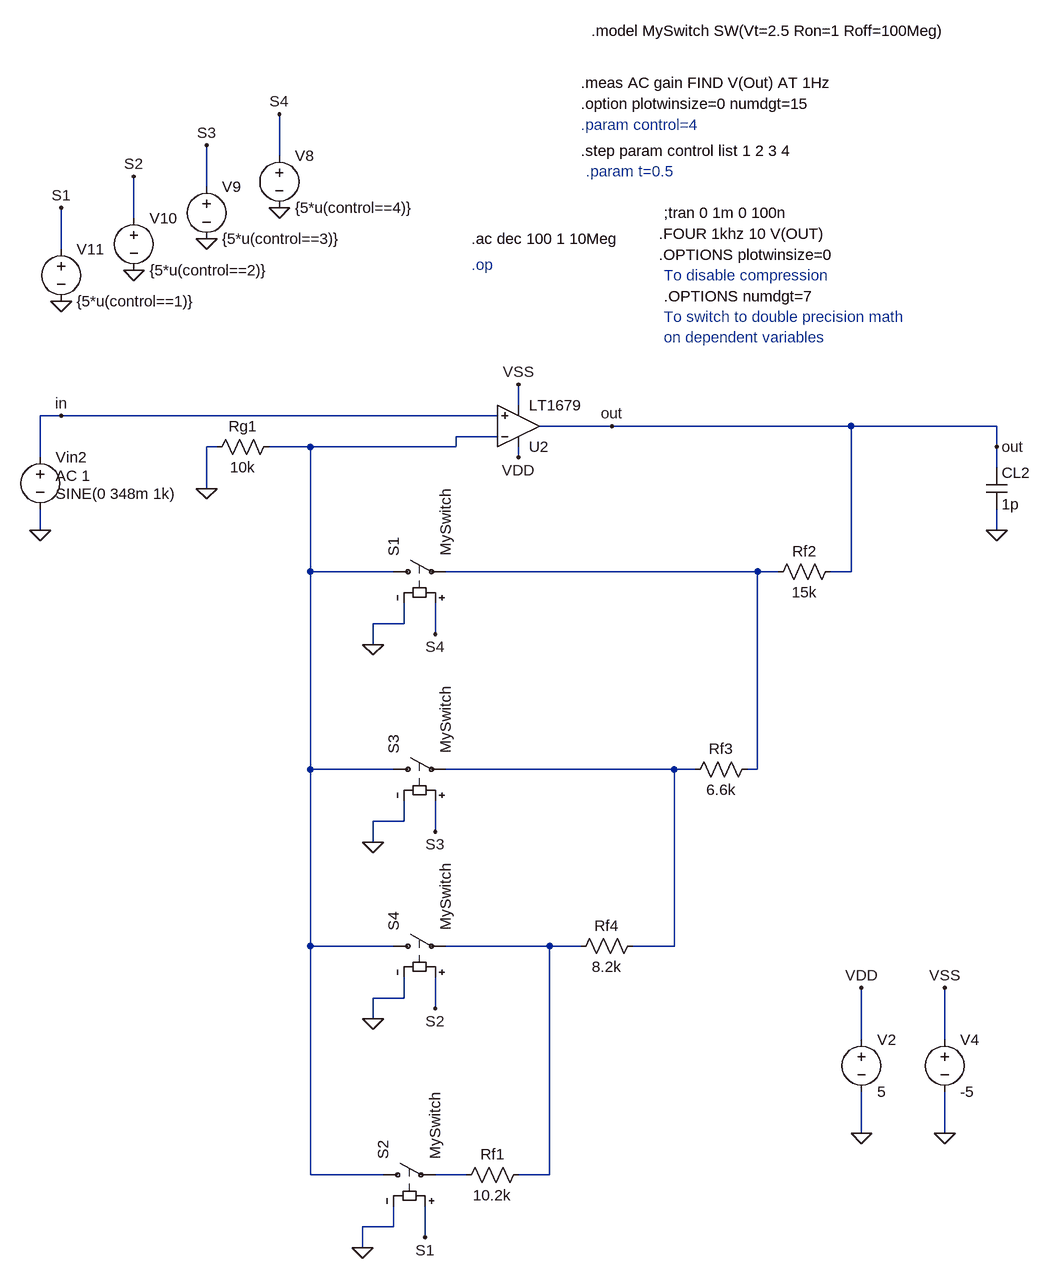
[diagram p0: schematic Etaj_3_PGA_ac.asc]
Etaj_3_PGA_ac.asc, the LTspice schematic file:
Version 4.1
SHEET 1 2136 1308
WIRE -880 -480 -880 -544
WIRE -992 -432 -992 -496
WIRE -1104 -384 -1104 -448
WIRE -1216 -336 -1216 -400
WIRE -512 -96 -512 -128
WIRE -1216 -80 -1248 -80
WIRE -544 -80 -1216 -80
WIRE -368 -64 -480 -64
WIRE 0 -64 -368 -64
WIRE 224 -64 0 -64
WIRE -544 -48 -608 -48
WIRE -976 -32 -992 -32
WIRE -832 -32 -896 -32
WIRE -608 -32 -608 -48
WIRE -608 -32 -832 -32
WIRE 224 -32 224 -64
WIRE -1248 -16 -1248 -80
WIRE -512 -16 -512 -32
WIRE 224 0 224 -32
WIRE -992 32 -992 -32
WIRE -1248 96 -1248 64
WIRE 224 96 224 64
WIRE -832 160 -832 -32
WIRE -704 160 -832 160
WIRE -144 160 -624 160
WIRE -112 160 -144 160
WIRE 0 160 0 -64
WIRE 0 160 -32 160
WIRE -688 240 -688 208
WIRE -688 240 -736 240
WIRE -640 256 -640 208
WIRE -736 272 -736 240
WIRE -832 464 -832 160
WIRE -704 464 -832 464
WIRE -272 464 -624 464
WIRE -240 464 -272 464
WIRE -144 464 -144 160
WIRE -144 464 -160 464
WIRE -688 544 -688 512
WIRE -688 544 -736 544
WIRE -640 560 -640 512
WIRE -736 576 -736 544
WIRE -832 736 -832 464
WIRE -704 736 -832 736
WIRE -464 736 -624 736
WIRE -416 736 -464 736
WIRE -272 736 -272 464
WIRE -272 736 -336 736
WIRE -688 816 -688 784
WIRE -688 816 -736 816
WIRE -640 832 -640 784
WIRE -736 848 -736 816
WIRE 16 880 16 800
WIRE 144 880 144 800
WIRE 16 1024 16 960
WIRE 144 1024 144 960
WIRE -832 1088 -832 736
WIRE -720 1088 -832 1088
WIRE -592 1088 -640 1088
WIRE -464 1088 -464 736
WIRE -464 1088 -512 1088
WIRE -704 1168 -704 1136
WIRE -704 1168 -752 1168
WIRE -656 1184 -656 1136
WIRE -752 1200 -752 1168
FLAG -1216 -256 0
FLAG -1104 -304 0
FLAG -992 -352 0
FLAG -880 -400 0
FLAG -1216 -400 S1
FLAG -1104 -448 S2
FLAG -992 -496 S3
FLAG -880 -544 S4
FLAG 16 1024 0
FLAG 16 800 VDD
FLAG -1248 96 0
FLAG -992 32 0
FLAG -368 -64 out
FLAG -512 -16 VDD
FLAG -512 -128 VSS
FLAG 224 96 0
FLAG -1216 -80 in
FLAG 144 1024 0
FLAG 144 800 VSS
FLAG -656 1184 S1
FLAG -736 272 0
FLAG -640 832 S2
FLAG -736 576 0
FLAG -640 560 S3
FLAG -736 848 0
FLAG -640 256 S4
FLAG -752 1200 0
FLAG 224 -32 out
DATAFLAG -1216 -368 ""
DATAFLAG -1104 -416 ""
DATAFLAG -992 -464 ""
DATAFLAG -880 -512 ""
DATAFLAG -720 -32 ""
DATAFLAG -112 -64 ""
DATAFLAG 112 -64 ""
SYMBOL voltage -880 -496 R0
WINDOW 123 0 0 Left 0
WINDOW 39 0 0 Left 0
SYMATTR InstName V8
SYMATTR Value {5*u(control==4)}
SYMBOL voltage -992 -448 R0
WINDOW 123 0 0 Left 0
WINDOW 39 0 0 Left 0
SYMATTR InstName V9
SYMATTR Value {5*u(control==3)}
SYMBOL voltage -1104 -400 R0
WINDOW 123 0 0 Left 0
WINDOW 39 0 0 Left 0
SYMATTR InstName V10
SYMATTR Value {5*u(control==2)}
SYMBOL voltage -1216 -352 R0
WINDOW 123 0 0 Left 0
WINDOW 39 0 0 Left 0
SYMATTR InstName V11
SYMATTR Value {5*u(control==1)}
SYMBOL voltage 16 864 R0
WINDOW 123 0 0 Left 2
WINDOW 39 0 0 Left 2
SYMATTR InstName V2
SYMATTR Value 5
SYMBOL res -880 -48 R90
WINDOW 0 0 56 VBottom 2
WINDOW 3 32 56 VTop 2
SYMATTR InstName Rg1
SYMATTR Value 10k
SYMBOL res -496 1072 R90
WINDOW 0 0 56 VBottom 2
WINDOW 3 32 56 VTop 2
SYMATTR InstName Rf1
SYMATTR Value 10.2k
SYMBOL voltage -1248 -32 R0
WINDOW 123 24 44 Left 2
WINDOW 39 0 0 Left 2
WINDOW 3 24 72 Left 2
SYMATTR Value2 AC 1
SYMATTR Value SINE(0 348m 1k)
SYMATTR InstName Vin2
SYMBOL res -16 144 R90
WINDOW 0 0 56 VBottom 2
WINDOW 3 32 56 VTop 2
SYMATTR InstName Rf2
SYMATTR Value 15k
SYMBOL res -144 448 R90
WINDOW 0 0 56 VBottom 2
WINDOW 3 32 56 VTop 2
SYMATTR InstName Rf3
SYMATTR Value 6.6k
SYMBOL res -320 720 R90
WINDOW 0 0 56 VBottom 2
WINDOW 3 32 56 VTop 2
SYMATTR InstName Rf4
SYMATTR Value 8.2k
SYMBOL cap 208 0 R0
SYMATTR InstName CL2
SYMATTR Value 1p
SYMBOL OpAmps\\LT1679 -512 -64 M180
SYMATTR InstName U2
SYMBOL voltage 144 864 R0
WINDOW 123 0 0 Left 2
WINDOW 39 0 0 Left 2
SYMATTR InstName V4
SYMATTR Value -5
SYMBOL sw -720 160 R270
SYMATTR InstName S1
SYMATTR Value MySwitch
SYMBOL sw -736 1088 R270
SYMATTR InstName S2
SYMATTR Value MySwitch
SYMBOL sw -720 464 R270
SYMATTR InstName S3
SYMATTR Value MySwitch
SYMBOL sw -720 736 R270
SYMATTR InstName S4
SYMATTR Value MySwitch
TEXT -584 -352 Left 2 !.ac dec 100 1 10Meg
TEXT -584 -312 Left 2 ;.op
TEXT -288 -392 Left 2 !;tran 0 1m 0 100n
TEXT -296 -360 Left 2 !.FOUR 1khz 10 V(OUT)
TEXT -296 -328 Left 2 !.OPTIONS plotwinsize=0
TEXT -288 -296 Left 2 ;To disable compression
TEXT -288 -264 Left 2 !.OPTIONS numdgt=7
TEXT -288 -232 Left 2 ;To switch to double precision math\non dependent variables
TEXT -416 -528 Left 2 ;.param control=4
TEXT -416 -488 Left 2 !.step param control list 1 2 3 4
TEXT -416 -592 Left 2 !.meas AC gain FIND V(Out) AT 1Hz
TEXT -416 -560 Left 2 !.option plotwinsize=0 numdgt=15
TEXT -408 -456 Left 2 ;.param t=0.5
TEXT -400 -672 Left 2 !.model MySwitch SW(Vt=2.5 Ron=1 Roff=100Meg)

The netlist it stands for:
* Etaj_3_PGA_ac.asc
V8 S4 0 {5*u(control==4)}
V9 S3 0 {5*u(control==3)}
V10 S2 0 {5*u(control==2)}
V11 S1 0 {5*u(control==1)}
V2 VDD 0 5
Rg1 N001 0 10k
Rf1 N004 N005 10.2k
Vin2 in 0 SINE(0 348m 1k) AC 1
Rf2 out N002 15k
Rf3 N002 N003 6.6k
Rf4 N003 N004 8.2k
CL2 out 0 1p
* U2: LT1679 (symbol OpAmps\LT1679 not available, pins judged from their places): In+=in In-=N001 V+=VDD V-=VSS OUT=out
V4 VSS 0 -5
S1 N001 N002 S4 0 MySwitch
S2 N001 N005 S1 0 MySwitch
S3 N001 N003 S3 0 MySwitch
S4 N001 N004 S2 0 MySwitch
.ac dec 100 1 10Meg
* .op
;tran 0 1m 0 100n
.FOUR 1khz 10 V(OUT)
.OPTIONS plotwinsize=0
* To disable compression
.OPTIONS numdgt=7
* To switch to double precision math
* on dependent variables
* .param control=4
.step param control list 1 2 3 4
.meas AC gain FIND V(Out) AT 1Hz
.option plotwinsize=0 numdgt=15
* .param t=0.5
.model MySwitch SW(Vt=2.5 Ron=1 Roff=100Meg)
.backanno
.end